# EAGLE design Wi07 Adapter (EAGLE 7.2.0)
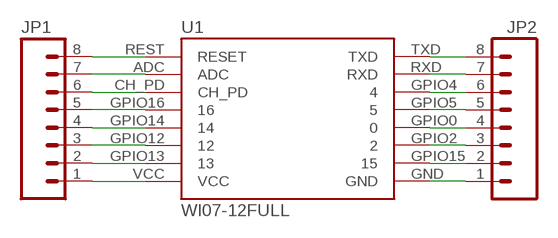
[diagram p0: schematic, sheet 1]

## Parts
JP1  M08  [1X08_PIN1_NO_SILK]
JP2  M08  [1X08_PIN1_NO_SILK]
U1  WI07-12FULL  [WI07-12]

## Nets
N$1: JP1.1 U1.VCC
N$2: JP1.2 U1.GPIO13
N$3: JP1.3 U1.GPIO12
N$4: JP1.4 U1.GPIO14
N$5: JP1.5 U1.GPIO16
N$6: JP1.6 U1.CH_PD
N$7: JP1.7 U1.ADC
N$8: JP1.8 U1.REST(RESET)
N$9: JP2.8 U1.TXD
N$10: JP2.7 U1.RXD
N$11: JP2.6 U1.GPIO4
N$12: JP2.5 U1.GPIO5
N$13: JP2.4 U1.GPIO0
N$14: JP2.3 U1.GPIO2
N$15: JP2.2 U1.GPIO15
N$16: JP2.1 U1.GND

## Library data of the parts
JP1 JP2 = SparkFun-Connectors:M08: Header 8 Standard 8-pin 0.1" header. Use with straight break away headers (SKU : PRT-00116), right angle break away headers (PRT-00553), swiss pins (PRT-00743), machine pins (PRT-00117), and female headers (PRT-00115).
U1 = ESP:WI07-12: Wi07-12 Footprint

## Board
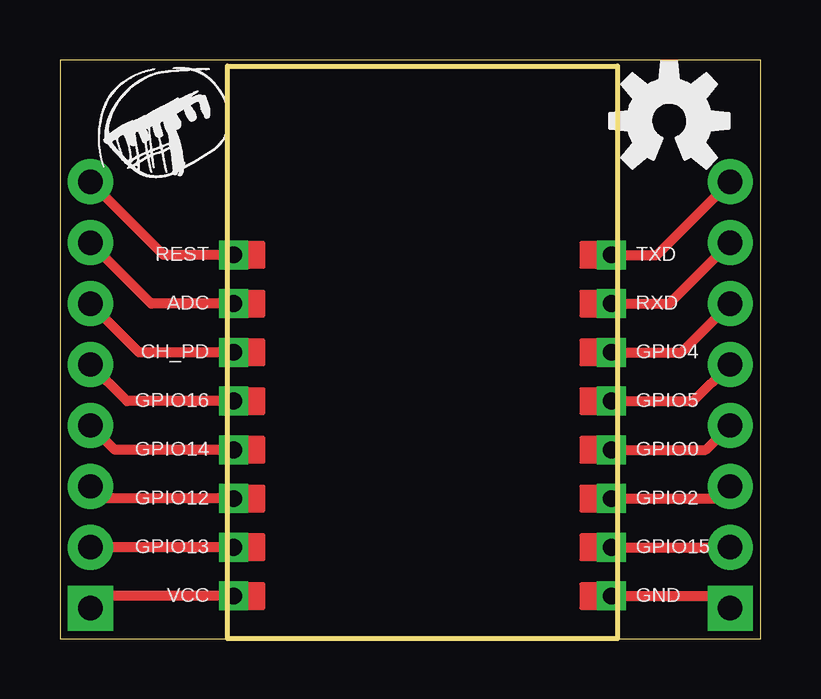
[diagram p1: board, top side]

Size 29.21 x 24.13 mm. Coordinates in mm from the lower left corner, seen from the top.
Outline: 0,0 29.21,0 29.21,24.13 0,24.13 0,0
Copper layers (1*16): Top 0.035mm / dielectric 1.5mm / Bottom 0.035mm
Design rules "default": minimum track width 10mil, minimum drill 24mil, track to track 8mil, track to pad 8mil, pad to pad 8mil, via to via 8mil, smd to smd 8mil, copper to edge 40mil, drill to drill 8mil, minimum pad ring 10mil, minimum via ring 8mil, stop-mask expansion 4mil, vias tented up to drill 0mil, thermal gap 10mil

### Footprints (pad centres in the part's own frame; a part is rotated, then mirrored left to right if it is on the bottom)
1X08_PIN1_NO_SILK = drill 1.016 pad 1.88 square: 1 0,0 | drill 1.016 pad 1.88: 2 2.54,0; 3 5.08,0; 4 7.62,0; 5 10.16,0; 6 12.7,0; 7 15.24,0; 8 17.78,0
WI07-12 = drill 0.699 square: ADC 0.254,13.97; CH_PD 0.254,11.938; GND 16.002,1.778; GPIO0 16.002,7.874; GPIO2 16.002,5.842; GPIO4 16.002,11.938; GPIO5 16.002,9.906; GPIO12 0.254,5.842; GPIO13 0.254,3.81; GPIO14 0.254,7.874; GPIO15 16.002,3.81; GPIO16 0.254,9.906; REST 0.254,16.002; RXD 16.002,13.97; TXD 16.002,16.002; VCC 0.254,1.778

### Placement (x,y rotation side)
JP1  1.27,1.27 90 top
JP2  27.94,1.27 90 top
U1  6.99,0 0 top
U$1  [OSHW-LOGO-M]  25.4,21.59 0 top
U$2  [HARK-S]  1.27,19.05 0 top

### Tracks (layer width: path | path; a pad name or v marks a point on that pad's centre or on a via)
N$1
  Top 0.406: U1.VCC 1.78,1.78 JP1.1
N$2
  Top 0.406: U1.GPIO13 JP1.2
N$3
  Top 0.406: U1.GPIO12 1.78,5.84 JP1.3
N$4
  Top 0.406: U1.GPIO14 2.29,7.87 JP1.4
N$5
  Top 0.406: U1.GPIO16 2.79,9.91 JP1.5
N$6
  Top 0.406: U1.CH_PD 3.3,11.94 JP1.6
N$7
  Top 0.406: U1.ADC 3.81,13.97 JP1.7
N$8
  Top 0.406: U1.REST 4.32,16 JP1.8
N$9
  Top 0.406: U1.TXD 24.89,16 JP2.8
N$10
  Top 0.406: U1.RXD 25.4,13.97 JP2.7
N$11
  Top 0.406: U1.GPIO4 25.91,11.94 JP2.6
N$12
  Top 0.406: U1.GPIO5 26.42,9.91 JP2.5
N$13
  Top 0.406: U1.GPIO0 26.92,7.87 JP2.4
N$14
  Top 0.406: U1.GPIO2 27.43,5.84 JP2.3
N$15
  Top 0.406: U1.GPIO15 JP2.2
N$16
  Top 0.406: U1.GND 27.43,1.78 JP2.1